# Altium schematic sheet AFE_DIFF.SchDoc
size A4; SheetNumber: 8; SheetTotal: 8
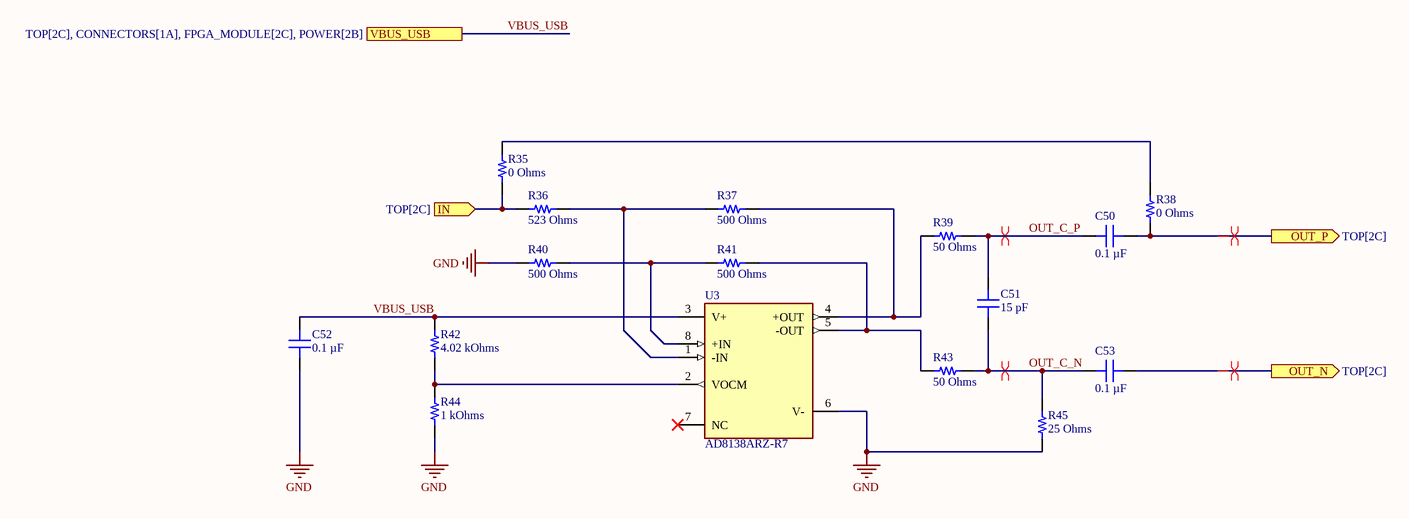
[diagram p0: AFE_DIFF.SchDoc]

## Parts
C50  0.1 µF  [CAP 0402_1005]
C51  15 pF  [CAP 0603_1608]
C52  0.1 µF  [CAP 0402_1005]
C53  0.1 µF  [CAP 0402_1005]
R35  0 Ohms  [RES 0603_1608]
R36  523 Ohms  [RES 0402_1005]
R37  500 Ohms  [RES 0603_1608]
R38  0 Ohms  [RES 0603_1608]
R39  50 Ohms  [RES 0603_1608]
R40  500 Ohms  [RES 0603_1608]
R41  500 Ohms  [RES 0603_1608]
R42  4.02 kOhms  [RES 0603_1608]
R43  50 Ohms  [RES 0603_1608]
R44  1 kOhms  [RES 0603_1608]
R45  25 Ohms  [RES 0402_1005]
U3  AD8138ARZ-R7  [FP-R-8-IPC_A]

## Ports
IN (in, see TOP[2C]), OUT_N (out, see TOP[2C]), OUT_P (out, see TOP[2C]), VBUS_USB (see TOP[2C], CONNECTORS[1A], FPGA_MODULE[2C], POWER[2B])

## Nets
GND: C52.1 R40.1 R44.1 R45.1 U3.6(V-)
IN: R35.1 R36.1 ; port IN
OUT_C_N: C51.1 C53.2 R43.2 R45.2
OUT_C_P: C50.2 C51.2 R39.2
OUT_N: C53.1 ; port OUT_N
OUT_P: C50.1 R38.1 ; port OUT_P
VBUS_USB: C52.2 R42.2 U3.3(V+) ; port VBUS_USB
NetR35_2: R35.2 R38.2
NetR36_2: R36.2 R37.1 U3.1(-IN)
NetR37_2: R37.2 R39.1 U3.4(+OUT)
NetR40_2: R40.2 R41.1 U3.8(+IN)
NetR41_2: R41.2 R43.1 U3.5(-OUT)
NetR42_1: R42.1 R44.2 U3.2(VOCM)

Not connected (* = marked no-connect by the designer): U3 7(NC)*

## Layout directives
differential pair: OUT_C_N, OUT_C_P, OUT_N, OUT_P

## Library data of the parts
C50 C52 C53 = CGA2B3X5R1H104M050BB: CAP CER 0.1UF 50V X5R 0402; manufacturer: TDK Corporation; Tolerance: ±20%; Part Number: CGA2B3X5R1H104M050BB; Value: 0.1 µF; Applications: Automotive; Capacitance: 0.1 µF; componentlink1description: Datasheet; componentlink1url: https://product.tdk.com/info/en/catalog/datasheets/mlcc_automotive_general_en.pdf?ref_disty=digikey; componentlink2description: DigiKey Link; componentlink2url: https://www.digikey.com/en/products/detail/tdk-corporation/CGA2B3X5R1H104M050BB/3949450; Device Package: 0402 (1005 Metric); lastupdated: 2022-07-21 3:55:54 AM; Lifecycle Status: Active; Minimum Order: 1; Mounting Type: Surface Mount, MLCC; Operating Temperature: -55°C ~ 85°C; Package / Case: 0402 (1005 Metric); packaging: TapeAndReel; partid: 1792; Part Status: Active; price: 0.02; Ratings: AEC-Q200; series: CGA; Size / Dimension: 0.039" L x 0.020" W (1.00mm x 0.50mm); Supplier 1: DigiKey; Supplier Part Number 1: 445-12214-1-ND; Temperature Coefficient: X5R; Thickness (Max): 0.022" (0.55mm); Voltage - Rated: 50V
C51 = C0603C150J3GACAUTO: CAP CER 15PF 25V C0G/NP0 0603; manufacturer: KEMET; Temperature Coefficient: C0G, NP0; Tolerance: ±5%; Part Number: C0603C150J3GACAUTO; Value: 15 pF; Applications: Automotive; Capacitance: 15 pF; componentlink1description: Datasheet; componentlink1url: https://api.kemet.com/component-edge/download/datasheet/C0603C150J3GACAUTO.pdf; componentlink2description: DigiKey Link; componentlink2url: https://www.digikey.com/en/products/detail/kemet/C0603C150J3GACAUTO/3314855; Device Package: 0603 (1608 Metric); Features: Low ESL; lastupdated: 2022-09-19 1:01:11 PM; Lifecycle Status: Active; Minimum Order: 1; Mounting Type: Surface Mount, MLCC; Operating Temperature: -55°C ~ 125°C; Package / Case: 0603 (1608 Metric); packaging: TapeAndReel; partid: 5370; Part Status: Active; price: 0.04; Ratings: AEC-Q200; series: SMD Auto C0G; Size / Dimension: 0.063" L x 0.031" W (1.60mm x 0.80mm); Supplier 1: DigiKey; Supplier Part Number 1: 399-6858-1-ND; Thickness (Max): 0.034" (0.87mm); Voltage - Rated: 25V
R35 R38 = 5110: RES SMD 0 OHM JUMPER 1/2W 0603; Part Number: 5110; Manufacturer: Keystone Electronics; Power (Watts): 0.5W, 1/2W; Value: 0 Ohms; ComponentLink1Description: Datasheet; ComponentLink1URL: http://keyelco.com/userAssets/file/M65p54.pdf; ComponentLink2Description: DigiKey Link; ComponentLink2URL: https://www.digikey.com/en/products/detail/keystone-electronics/5110/5118870; Composition: Metal Element; Device Package: 0603 (1608 Metric); Height - Seated (Max): 0.028" (0.70mm); LastUpdated: 2022-09-14 8:08:57 AM; Lifecycle Status: Active; Minimum Order: 1; Number of Terminations: 2; Package / Case: 0603 (1608 Metric); Packaging: TapeAndReel; PartId: 20779; Part Status: Active; Price: 0.16; Resistance: 0 Ohms; Series: -; Size / Dimension: 0.061" L x 0.033" W (1.55mm x 0.85mm); Supplier 1: DigiKey; Supplier Part Number 1: 36-5110CT-ND; Supplier Device Package: 0603; Tolerance: Jumper
R36 = ERA-2ARB5230X: RES SMD 523 OHM 0.1% 1/16W 0402; Manufacturer: Panasonic Electronic Components; Power (Watts): 0.063W, 1/16W; Temperature Coefficient: ±10ppm/°C; Part Number: ERA-2ARB5230X; Value: 523 Ohms; ComponentLink1Description: Datasheet; ComponentLink1URL: https://industrial.panasonic.com/cdbs/www-data/pdf/RDM0000/AOA0000C307.pdf; ComponentLink2Description: DigiKey Link; ComponentLink2URL: https://www.digikey.com/en/products/detail/panasonic-electronic-components/ERA-2ARB5230X/5162143; Composition: Thin Film; Device Package: 0402 (1005 Metric); Features: Automotive AEC-Q200; Height - Seated (Max): 0.016" (0.40mm); LastUpdated: 2022-09-19 1:14:41 PM; Lifecycle Status: Active; Minimum Order: 1; Number of Terminations: 2; Operating Temperature: -55°C ~ 155°C; Package / Case: 0402 (1005 Metric); Packaging: TapeAndReel; PartId: 8974; Part Status: Active; Price: 0.24; Ratings: AEC-Q200; Resistance: 523 Ohms; Series: ERA-2A; Size / Dimension: 0.039" L x 0.020" W (1.00mm x 0.50mm); Supplier 1: DigiKey; Supplier Part Number 1: P18082CT-ND; Supplier Device Package: 0402; Tolerance: ±0.1%
R37 R40 R41 = TNPU0603500RAZEN00: RES SMD 500 OHM 0.05% 1/10W 0603; Manufacturer: Vishay Dale; Power (Watts): 0.1W, 1/10W; Temperature Coefficient: ±5ppm/°C; Part Number: TNPU0603500RAZEN00; Value: 500 Ohms; ComponentLink1Description: Datasheet; ComponentLink1URL: http://www.vishay.com/docs/28779/tnpue3.pdf; ComponentLink2Description: DigiKey Link; ComponentLink2URL: http://digikey.com/product-detail/en/vishay-dale/TNPU0603500RAZEN00/541-3301-1-ND/6615958; Composition: Thin Film; Device Package: 0603 (1608 Metric); Features: Anti-Sulfur, Automotive AEC-Q200, Moisture Resistant; Height - Seated (Max): 0.022" (0.55mm); LastUpdated: 2022-09-19 1:22:08 PM; Lifecycle Status: Active; Minimum Order: 1; Number of Terminations: 2; Operating Temperature: -55°C ~ 125°C; Package / Case: 0603 (1608 Metric); Packaging: TapeAndReel; PartId: 11840; Part Status: Active; Price: 1.20; Ratings: AEC-Q200; Resistance: 500 Ohms; Series: TNPU; Size / Dimension: 0.063" L x 0.033" W (1.60mm x 0.85mm); Supplier 1: DigiKey; Supplier Part Number 1: 541-3301-1-ND; Supplier Device Package: 0603; Tolerance: ±0.05%
R39 R43 = CH0603-50RJNTA: RES 50 OHM 5% 1/8W 0603; Manufacturer: Vishay Sfernice; Power (Watts): 0.125W, 1/8W; Temperature Coefficient: ±100ppm/°C; Part Number: CH0603-50RJNTA; Value: 50 Ohms; ComponentLink1Description: Datasheet; ComponentLink1URL: http://www.vishay.com/docs/53014/ch.pdf; ComponentLink2Description: DigiKey Link; ComponentLink2URL: https://www.digikey.com/en/products/detail/vishay-sfernice/CH0603-50RJNTA/9405753; Composition: Thin Film; Device Package: 0603 (1608 Metric); Features: RF, High Frequency; Height - Seated (Max): 0.025" (0.63mm); LastUpdated: 2022-09-19 1:22:06 PM; Lifecycle Status: Active; Minimum Order: 1; Number of Terminations: 2; Operating Temperature: -55°C ~ 155°C; Package / Case: 0603 (1608 Metric); Packaging: TapeAndReel; PartId: 12205; Part Status: Active; Price: 3.51; Resistance: 50 Ohms; Series: CH; Size / Dimension: 0.060" L x 0.030" W (1.52mm x 0.76mm); Supplier 1: DigiKey; Supplier Part Number 1: 716-1163-1-ND; Supplier Device Package: 0603; Tolerance: ±5%
R42 = AC0603FR-074K02L: RES SMD 4.02K OHM 1% 1/10W 0603; Manufacturer: Yageo; Power (Watts): 0.1W, 1/10W; Temperature Coefficient: ±100ppm/°C; Part Number: AC0603FR-074K02L; Value: 4.02 kOhms; ComponentLink1Description: Datasheet; ComponentLink1URL: https://www.yageo.com/upload/media/product/productsearch/datasheet/rchip/PYu-AC_51_RoHS_L_7.pdf; ComponentLink2Description: DigiKey Link; ComponentLink2URL: https://www.digikey.com/en/products/detail/yageo/AC0603FR-074K02L/5896151; Composition: Thick Film; Device Package: 0603 (1608 Metric); Features: Automotive AEC-Q200, Moisture Resistant; Height - Seated (Max): 0.022" (0.55mm); LastUpdated: 2022-09-19 1:21:09 PM; Lifecycle Status: Active; Minimum Order: 1; Number of Terminations: 2; Operating Temperature: -55°C ~ 155°C; Package / Case: 0603 (1608 Metric); Packaging: CutTape; PartId: 24892; Part Status: Active; Price: 0.01; Ratings: AEC-Q200; Resistance: 4.02 kOhms; Series: AC; Size / Dimension: 0.063" L x 0.031" W (1.60mm x 0.80mm); Supplier 1: DigiKey; Supplier Part Number 1: YAG5341CT-ND; Supplier Device Package: 0603; Tolerance: ±1%
R44 = AA0603FR-071KL: RES SMD 1K OHM 1% 1/10W 0603; Manufacturer: Yageo; Power (Watts): 0.1W, 1/10W; Temperature Coefficient: ±150ppm/°C; Part Number: AA0603FR-071KL; Value: 1 kOhms; ComponentLink1Description: Datasheet; ComponentLink1URL: https://www.yageo.com/upload/media/product/productsearch/datasheet/rchip/PYu-AA_51_RoHS_L_3.pdf; ComponentLink2Description: DigiKey Link; ComponentLink2URL: https://www.digikey.com/en/products/detail/yageo/AA0603FR-071KL/5888847; Composition: Thick Film; Device Package: 0603 (1608 Metric); Features: Anti-Sulfur, Automotive AEC-Q200, Moisture Resistant; Height - Seated (Max): 0.022" (0.55mm); LastUpdated: 2022-09-19 1:20:47 PM; Lifecycle Status: Active; Minimum Order: 1; Number of Terminations: 2; Operating Temperature: -55°C ~ 155°C; Package / Case: 0603 (1608 Metric); Packaging: TapeAndReel; PartId: 64335; Part Status: Active; Price: 0.01; Ratings: AEC-Q200; Resistance: 1 kOhms; Series: AA; Size / Dimension: 0.063" L x 0.031" W (1.60mm x 0.80mm); Supplier 1: DigiKey; Supplier Part Number 1: 13-AA0603FR-071KLCT-ND; Supplier Device Package: 0603; Tolerance: ±1%
R45 = FC0402E25R0BST0: RES 25 OHM 0.1% 1/20W 0402; Manufacturer: Vishay Thin Film; Power (Watts): 0.05W, 1/20W; Temperature Coefficient: ±25ppm/°C; Part Number: FC0402E25R0BST0; Value: 25 Ohms; ComponentLink1Description: Datasheet; ComponentLink1URL: http://www.vishay.com/docs/60093/fcseries.pdf; ComponentLink2Description: DigiKey Link; ComponentLink2URL: http://digikey.com/product-detail/en/vishay-thin-film/FC0402E25R0BST0/764-1327-1-ND/7103111; Composition: Thin Film; Device Package: 0402 (1005 Metric); Features: RF, High Frequency; Height - Seated (Max): 0.015" (0.38mm); LastUpdated: 2022-09-19 1:14:33 PM; Lifecycle Status: Active; Minimum Order: 1; Number of Terminations: 2; Operating Temperature: -55°C ~ 155°C; Package / Case: 0402 (1005 Metric); Packaging: TapeAndReel; PartId: 11457; Part Status: Active; Price: 2.00; Resistance: 25 Ohms; Series: FC; Size / Dimension: 0.042" L x 0.022" W (1.07mm x 0.56mm); Supplier 1: DigiKey; Supplier Part Number 1: 764-1327-1-ND; Supplier Device Package: 0402; Tolerance: ±0.1%
U3 = CMP-09081-000074-1: IC ADC DRIVER 8SOIC; Input Offset Voltage (Vos): 1mV; Voltage Gain: 0.028dB; Operating Supply Current: 20mA; Number of Channels: 1; Max Power Dissipation: 550mW; Input Bias Current: 7uA; Input Resistance: 6MR; -3db Bandwidth: 320MHz; Slew Rate: 1150V/µs; Min Supply Voltage: 2.7V; Operating Supply Voltage: 9V; Max Supply Voltage: 11V; Min Dual Supply Voltage: 1.4V; Common Mode Rejection Ratio: 70dB; Max Dual Supply Voltage: 5.5V; Lead Free: Contains Lead; Radiation Hardening: No; Mount: Surface Mount; Nominal Supply Current: 20mA; Package Quantity: 1000; Case/Package: SOIC; Series: -; Min Operating Temperature: -40°C; Packaging: Tape and Reel; Bandwidth: 320MHz; Number of Elements: 1; Power Dissipation: 550mW; Number of Pins: 8; RoHS Compliant: Yes; Gain Bandwidth Product: 320MHz; Number of Circuits: 1; Power Supply Rejection Ratio (PSRR): 70dB; Supply Current: 20mA; Max Operating Temperature: 85°C